# EAGLE design usb_ppm-v0.2 (EAGLE 8.7.1)
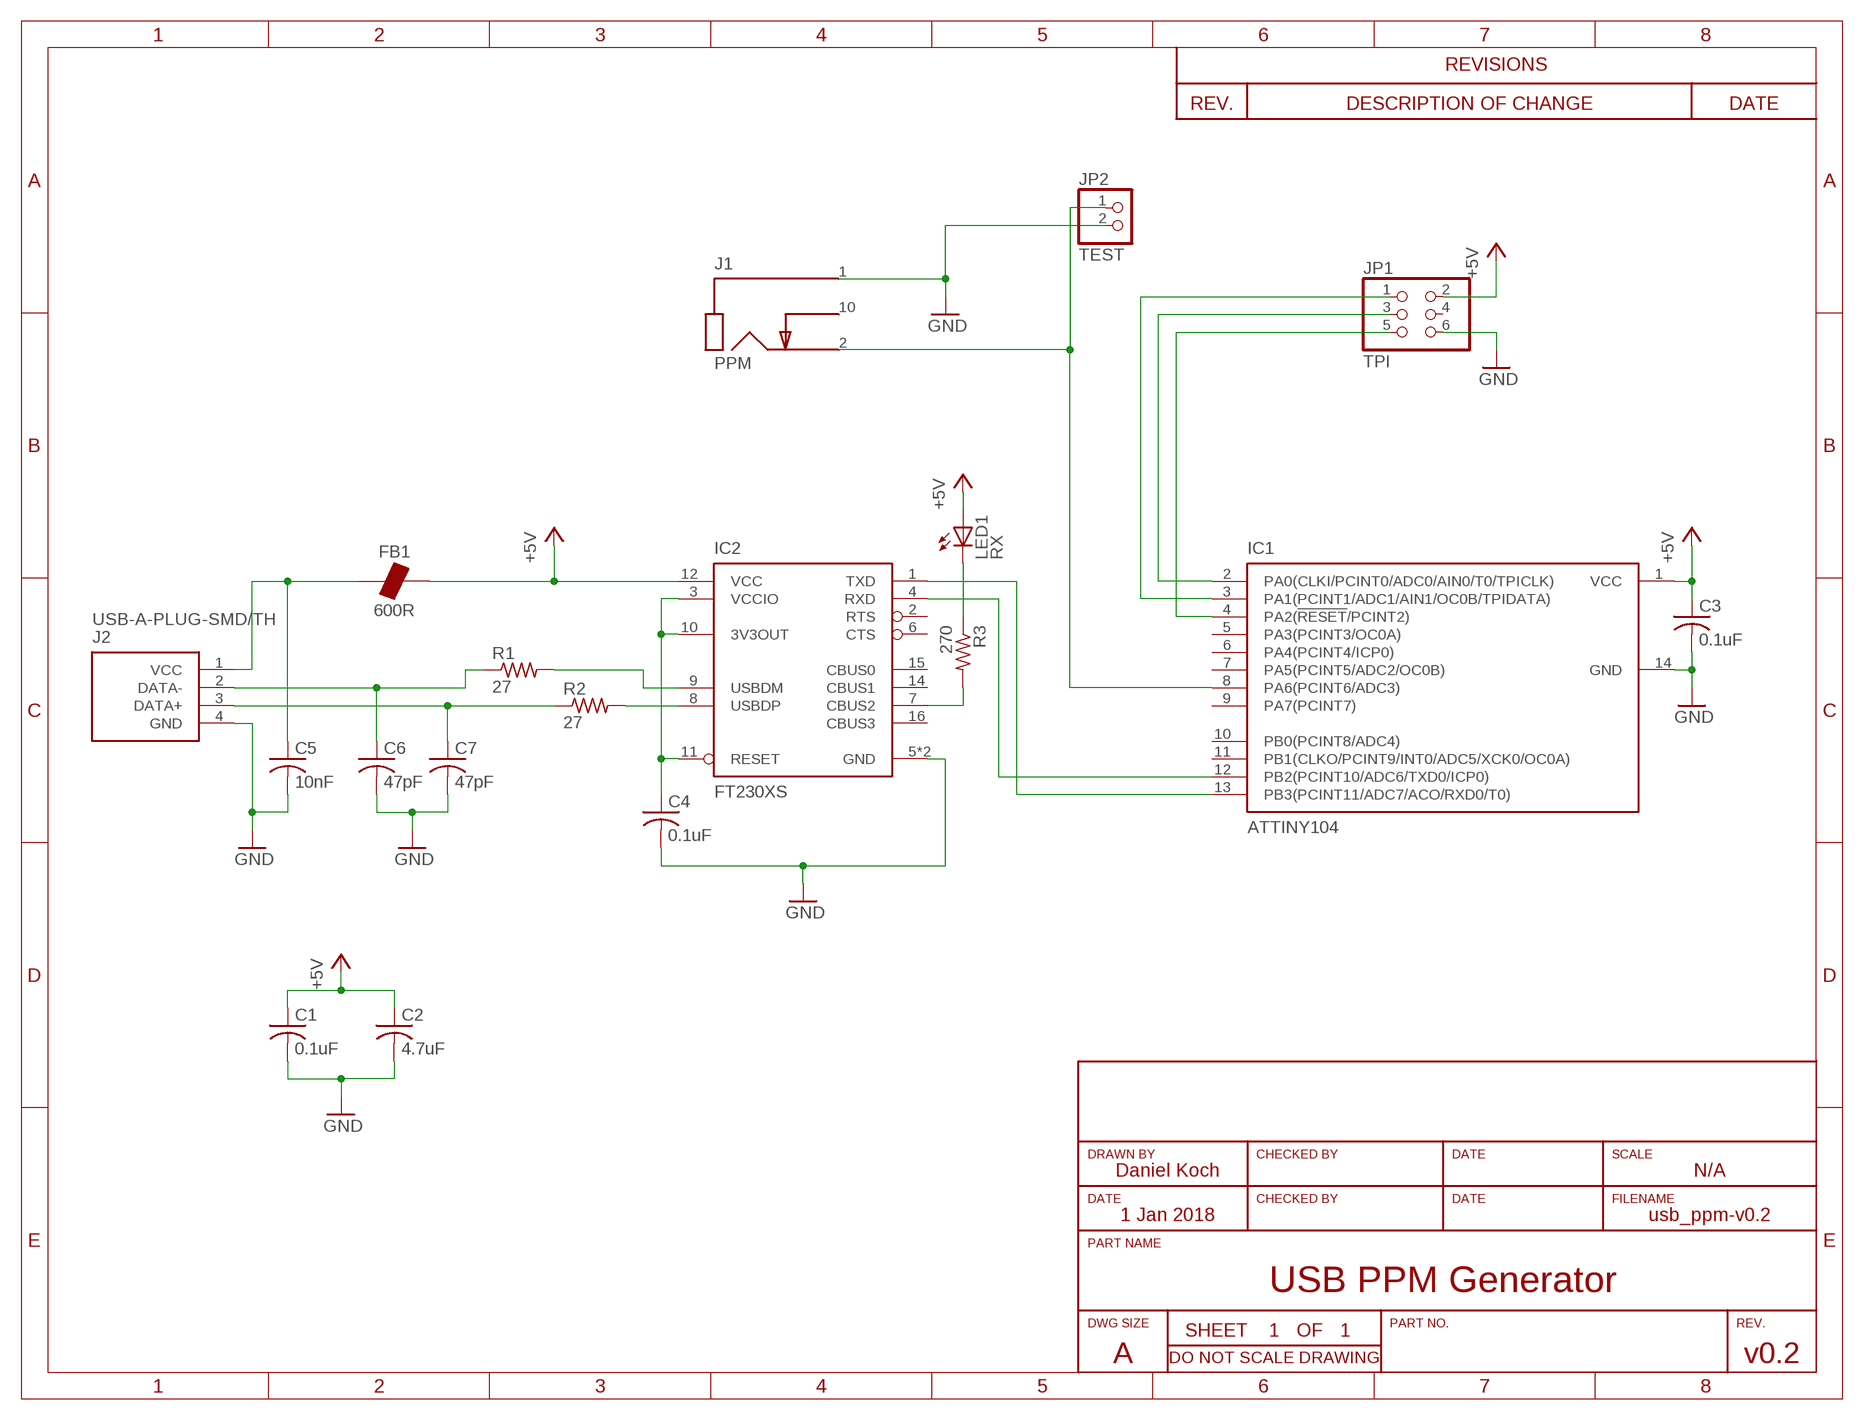
[diagram p0: schematic, sheet 1]
U$1 (FRAME_LETTER): DB_DATE: 1 Jan 2018; DB_NAME: Daniel Koch; DRAWINGSIZE: A; PARTNAME: USB PPM Generator; REV: v0.2; SCALE: N/A

## Parts
C1  0.1uF  C-USC0603  [C0603]
C2  4.7uF  C-USC0603  [C0603]
C3  0.1uF  C-USC0603  [C0603]
C4  0.1uF  C-USC0603  [C0603]
C5  10nF  C-USC0603  [C0603]
C6  47pF  C-USC0603  [C0603]
C7  47pF  C-USC0603  [C0603]
FB1  600R  FB0603  [0603]
IC1  ATTINY104  [SOIC-14]
IC2  FT230XS  [SSOP-16]
J1  PPM  MJ-3523-SMT  [MJ-3523-SMT]
J2  USB-A-PLUG-SMD/TH  [USB-A-MALE-SMD/TH]
JP1  TPI  PINHD-2X3  [2X03]
JP2  TEST  PINHD-1X2  [1X02]
LED1  RX  LEDCHIP-LED0603  [CHIP-LED0603]
R1  27  R-US_R0603  [R0603]
R2  27  R-US_R0603  [R0603]
R3  270  R-US_R0603  [R0603]

## Nets
3V3OUT: C4.1 IC2.3(VCCIO) IC2.10(3V3OUT) IC2.11(RESET)
+5V: C1.1 C2.1 C3.1 FB1.2 IC1.1(VCC) IC2.12(VCC) JP1.2 LED1.A
GND: C1.2 C2.2 C3.2 C4.2 C5.2 C6.2 C7.2 IC1.14(GND) IC2.5(GND) IC2.13(GND) J1.1(SLEEVE) J2.4(GND) JP1.6 JP2.2
N$1: IC1.13(PB3(PCINT11/ADC7/ACO/RXD0/T0)) IC2.1(TXD)
N$2: IC1.12(PB2(PCINT10/ADC6/TXD0/ICP0)) IC2.4(RXD)
N$3: IC1.8(PA6(PCINT6/ADC3)) J1.2(TIP) JP2.1
N$4: C5.1 FB1.1 J2.1(VCC)
N$5: LED1.C R3.1
N$6: C6.1 J2.2(DATA-) R1.1
N$7: C7.1 J2.3(DATA+) R2.1
N$8: IC2.9(USBDM) R1.2
N$9: IC2.8(USBDP) R2.2
N$10: IC2.7(CBUS2) R3.2
N$11: IC1.3(PA1(PCINT1/ADC1/AIN1/OC0B/TPIDATA)) JP1.1
N$12: IC1.2(PA0(CLKI/PCINT0/ADC0/AIN0/T0/TPICLK)) JP1.3
N$13: IC1.4(PA2(!RESET!/PCINT2)) JP1.5
Unconnected: IC1.5(PA3(PCINT3/OC0A)) IC1.6(PA4(PCINT4/ICP0)) IC1.7(PA5(PCINT5/ADC2/OC0B)) IC1.9(PA7(PCINT7)) IC1.10(PB0(PCINT8/ADC4)) IC1.11(PB1(CLKO/PCINT9/INT0/ADC5/XCK0/OC0A)) IC2.2(RTS) IC2.6(CTS) IC2.14(CBUS1) IC2.15(CBUS0) IC2.16(CBUS3) J1.10(SWITCH) JP1.4

## Library data of the parts
C1-C7 = rcl:C-US: CAPACITOR, American symbol; SPICEPREFIX: C
FB1 = discrete:FB: Ferrite Bead Ferrite bead for power/signal filtering
IC1 = IC:ATTINY104: ATtiny104 8-bit AVR Microcontroller
IC2 = IC:FT230X: FT230X FTDI FT230X USB to Basic UART
J1 = connector:MJ-3523-SMT: MJ-3523-SMT 3.5mm surface mount audio jack, mono
J2 = connector:USB-A-PLUG; DIGIKEY_PN: WM3983CT-ND; MFG: Molex, LLC; MFG_PN: 0480372200
JP1 = pinhead:PINHD-2X3: PIN HEADER
JP2 = pinhead:PINHD-1X2: PIN HEADER
LED1 = led:LED: LED OSRAM: - CHIPLED LG R971, LG N971, LY N971, LG Q971, LY Q971, LO R971, LY R971 LH N974, LH R974 LS Q976, LO Q976, LY Q976 LO Q996 - Hyper CHIPLED LW Q18S LB Q993, LB Q99A, LB R99A - SideLED LS A670, LO A670, LY A670, LG A670, LP A670 LB A673, LV A673, LT A673, LW A673 LH A674 LY A675 LS A676, LA A676, LO A676, LY A676, LW A676 LS A679, LY A679, LG A679 - Hyper Micro SIDELED® LS Y876, LA Y876, LO Y876, LY Y876 LT Y87S - SmartLED LW L88C, LW L88S LB L89C, LB L89S, LG L890 LS L89K, LO L89K, LY L89K LS L896, LA L896, LO L896, LY L896 - TOPLED LS T670, LO T670, LY T670, LG T670, LP T670 LSG T670, LSP T670, LSY T670, LOP T670, LYG T670 LG T671, LOG T671, LSG T671 LB T673, LV T673, LT T673, LW T673 LH T674 LS T676, LA T676, LO T676, LY T676, LB T676, LH T676, LSB T676, LW T676 LB T67C, LV T67C, LT T67C, LS T67K, LO T67K, LY T67K, LW E67C LS E67B, LA E67B, LO E67B, LY E67B, LB E67C, LV E67C, LT E67C LW T67C LS T679, LY T679, LG T679 LS T770, LO T770, LY T770, LG T770, LP T770 LB T773, LV T773, LT T773, LW T773 LH T774 LS E675, LA E675, LY E675, LS T675 LS T776, LA T776, LO T776, LY T776, LB T776 LHGB T686 LT T68C, LB T68C - Hyper Mini TOPLED® LB M676 - Mini TOPLED Santana® LG M470 LS M47K, LO M47K, LY M47K Source: http://www.osram.convergy.de LUXEON: - LUMILED® LXK2-PW12-R00, LXK2-PW12-S00, LXK2-PW14-U00, LXK2-PW14-V00 LXK2-PM12-R00, LXK2-PM12-S00, LXK2-PM14-U00 LXK2-PE12-Q00, LXK2-PE12-R00, LXK2-PE12-S00, LXK2-PE14-T00, LXK2-PE14-U00 LXK2-PB12-K00, LXK2-PB12-L00, LXK2-PB12-M00, LXK2-PB14-N00, LXK2-PB14-P00, LXK2-PB14-Q00 LXK2-PR12-L00, LXK2-PR12-M00, LXK2-PR14-Q00, LXK2-PR14-R00 LXK2-PD12-Q00, LXK2-PD12-R00, LXK2-PD12-S00 LXK2-PH12-R00, LXK2-PH12-S00 LXK2-PL12-P00, LXK2-PL12-Q00, LXK2-PL12-R00 Source: www.luxeon.com KINGBRIGHT: KA-3528ASYC Source: www.kingbright.com
R1-R3 = rcl:R-US_: RESISTOR, American symbol; SPICEPREFIX: R

## Board
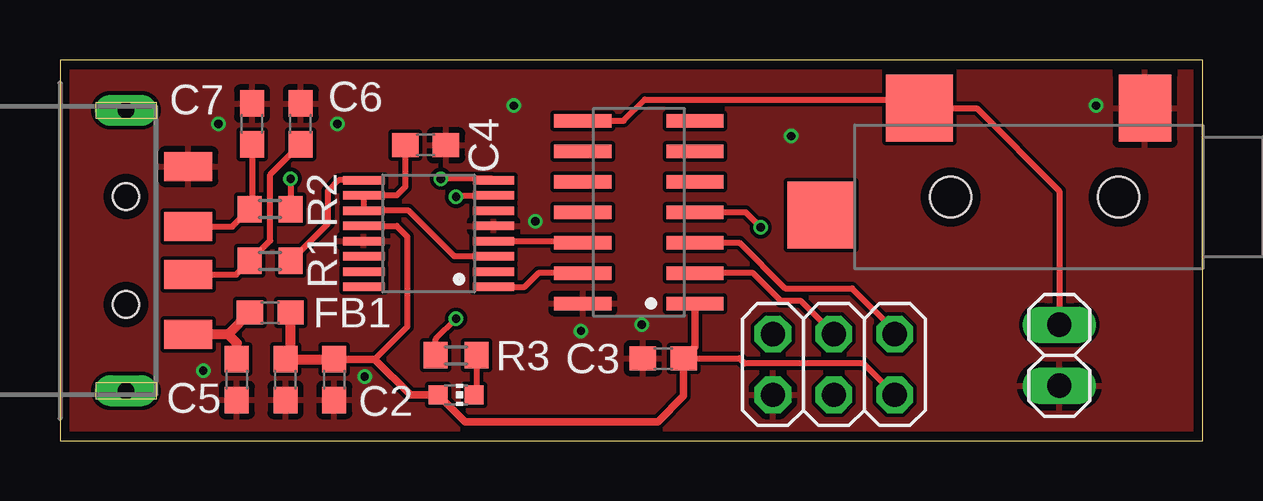
[diagram p1: board, top side]
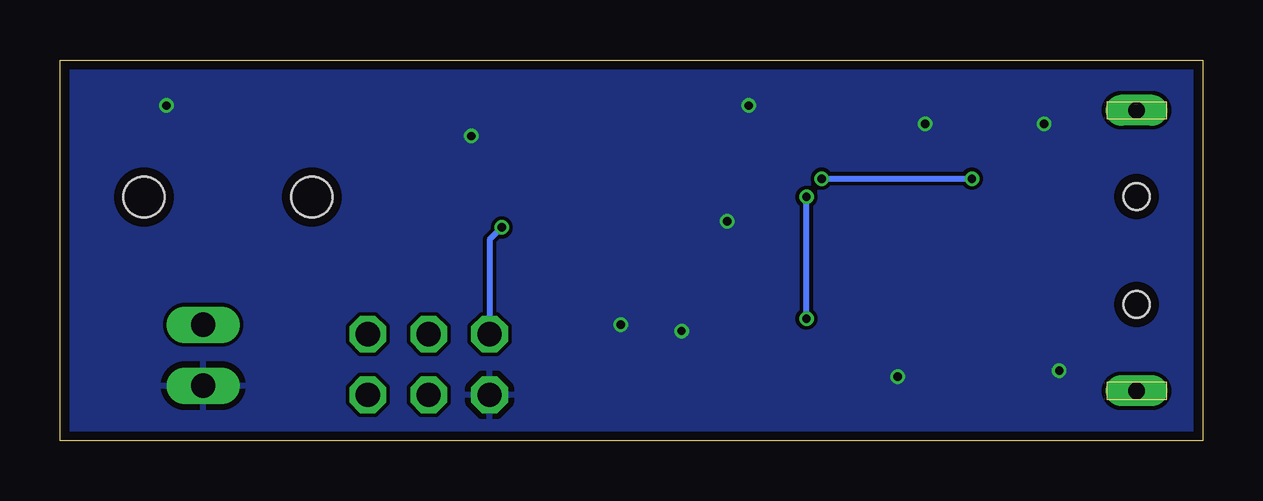
[diagram p2: board, bottom side, seen from below]

Size 47.62 x 15.88 mm. Coordinates in mm from the lower left corner, seen from the top.
Outline: 0,0 47.62,0 47.62,15.88 0,15.88 0,0
Copper layers (1*16): Top 0.035559375mm / dielectric 1.6mm / Bottom 0.035559375mm
Design rules "oshpark-2layer": minimum track width 6mil, minimum drill 10mil, track to track 6mil, track to pad 6mil, pad to pad 6mil, via to via 6mil, smd to smd 6mil, copper to edge 15mil, drill to drill 6mil, minimum pad ring 5mil, minimum via ring 5mil, stop-mask expansion 2.5mil, vias tented up to drill 0mil, thermal gap 10mil

### Footprints (pad centres in the part's own frame; a part is rotated, then mirrored left to right if it is on the bottom)
C0603 = smd 1.1 x 1: 1 -0.85,0; 2 0.85,0
0603 = smd 1.1 x 1: 1 -0.85,0; 2 0.85,0
SOIC-14 = smd 0.559 x 2.388: 1 -3.81,-2.337; 2 -2.54,-2.337; 3 -1.27,-2.337; 4 0,-2.337; 5 1.27,-2.337; 6 2.54,-2.337; 7 3.81,-2.337; 8 3.81,2.337; 9 2.54,2.337; 10 1.27,2.337; 11 0,2.337; 12 -1.27,2.337; 13 -2.54,2.337; 14 -3.81,2.337
SSOP-16 = smd 0.356 x 1.727: 1 -2.223,-2.705; 2 -1.587,-2.705; 3 -0.953,-2.705; 4 -0.318,-2.705; 5 0.318,-2.705; 6 0.953,-2.705; 7 1.587,-2.705; 8 2.223,-2.705; 9 2.223,2.705; 10 1.587,2.705; 11 0.953,2.705; 12 0.318,2.705; 13 -0.318,2.705; 14 -0.953,2.705; 15 -1.587,2.705; 16 -2.223,2.705
MJ-3523-SMT = smd 2.2 x 2.8: 1 2.4,-3.7 | smd 2.8 x 2.8: 2 11.8,-3.7; 10 15.9,0.75 | hole 1.7: 3.5,0; 10.5,0
USB-A-MALE-SMD/TH = smd 1.2 x 2: 1 3.5,5.35; 2 1,5.35; 3 -1,5.35; 4 -3.5,5.35 | drill 0.7 pad 1.3 long: SHIELD1 -5.85,2.75; SHIELD2 5.85,2.75 | hole 1.1: -2.25,2.75; 2.25,2.75
2X03 = drill 1.016 octagon: 1 -2.54,-1.27; 2 -2.54,1.27; 3 0,-1.27; 4 0,1.27; 5 2.54,-1.27; 6 2.54,1.27
1X02 = drill 1.016 long: 1 -1.27,0; 2 1.27,0
CHIP-LED0603 = smd 0.8 x 0.8: A 0,-0.75; C 0,0.75
R0603 = smd 1 x 1.1: 1 -0.85,0; 2 0.85,0

### Placement (x,y rotation side)
C1  9.4,2.54 270 top
C2  11.43,2.54 270 top
C3  25.15,3.43 180 top
C4  15.24,12.32 0 top
C5  7.37,2.54 270 top
C6  10.03,13.21 90 top
C7  8,13.21 90 top
FB1  8.76,5.33 0 top
IC1  24.13,9.53 90 top
IC2  15.37,8.64 90 top
J1  47.62,10.16 180 top
J2  0,7.92 270 top
JP1  32.26,3.17 180 top
JP2  41.66,3.56 270 top
LED1  16.51,1.91 270 top
R1  8.76,7.49 0 top
R2  8.76,9.65 0 top
R3  16.51,3.56 180 top

### Tracks (layer width: path | path; a pad name or v marks a point on that pad's centre or on a via)
3V3OUT
  Top 0.254: C4.1 14.39,10.58 14.03,10.22 IC2.10 IC2.11 14.54,9.59 16.45,7.68 IC2.3
+5V
  Top 0.254: IC2.12 14.03,8.95 14.48,8.51 14.48,4.75 13.12,3.39 | C3.1 28.32,3.43 28.54,3.21 33.49,3.21 JP1.2
  Top 0.305: C2.1 13.12,3.39 14.61,1.91 LED1.A 16.88,0.79 24.92,0.79 26,1.87 C3.1 26.47,3.9 IC1.1
  Top 0.406: FB1.2 9.61,3.6 C1.1 C2.1
GND  (via drill 0.35)
  other vias: 6.6,13.21 11.56,13.21 5.97,2.92 12.7,2.67 18.92,13.97 24.26,4.83 30.48,12.7 43.18,13.97 21.72,4.57 19.81,9.14
  pour Top: 0,15.88 47.62,15.88 47.62,0 0,0
  pour Bottom: 0,15.88 47.62,15.88 47.62,0 0,0
N$1
  Top 0.254: IC2.1 19.37,6.41 19.94,6.99 IC1.13
N$2
  Top 0.254: IC2.4 21.73,8.32 IC1.12
N$3
  Top 0.254: IC1.8 23.5,13.34 24.38,14.22 35.46,14.22 J1.2 38.21,13.86 41.66,10.41 JP2.1
N$4
  Top 0.406: FB1.1 7,4.42 | 7,4.42 J2.1 | C5.1 7.37,4.06 7,4.42
N$5
  Top 0.254: R3.1 17.36,2 LED1.C
N$6
  Top 0.254: J2.2 7.34,6.92 R1.1 8.76,8.34 8.76,11.09 C6.1
N$7
  Top 0.254: J2.3 7.19,8.93 R2.1 8,9.74 C7.1
N$8
  Top 0.254: R1.2 11.18,9.06 11.18,10.41 11.62,10.86 IC2.9
N$9  (via drill 0.35)
  Top 0.254: IC2.8 18.01,10.92 v15.88,10.92 | v9.61,10.92 R2.2
  Bottom 0.254: v15.88,10.92 v9.61,10.92
N$10  (via drill 0.35)
  Top 0.254: R3.2 15.66,4.23 v16.51,5.08 | v16.51,10.16 16.57,10.22 IC2.7
  Bottom 0.254: v16.51,5.08 v16.51,10.16
N$11
  Top 0.254: IC1.3 28.32,8.26 30.23,6.35 33.02,6.35 34.8,4.57 JP1.1
N$12
  Top 0.254: JP1.3 30.89,5.82 30.06,5.82 28.89,6.99 IC1.2
N$13  (via drill 0.35)
  Top 0.254: IC1.4 28.57,9.53 v29.21,8.89
  Bottom 0.254: v29.21,8.89 29.72,8.38 JP1.5

### Text on the board
tValues: PPM | 5 | 1 | 6 | 2 | GND